# EAGLE design USB - UART link (EAGLE 8.0.1)
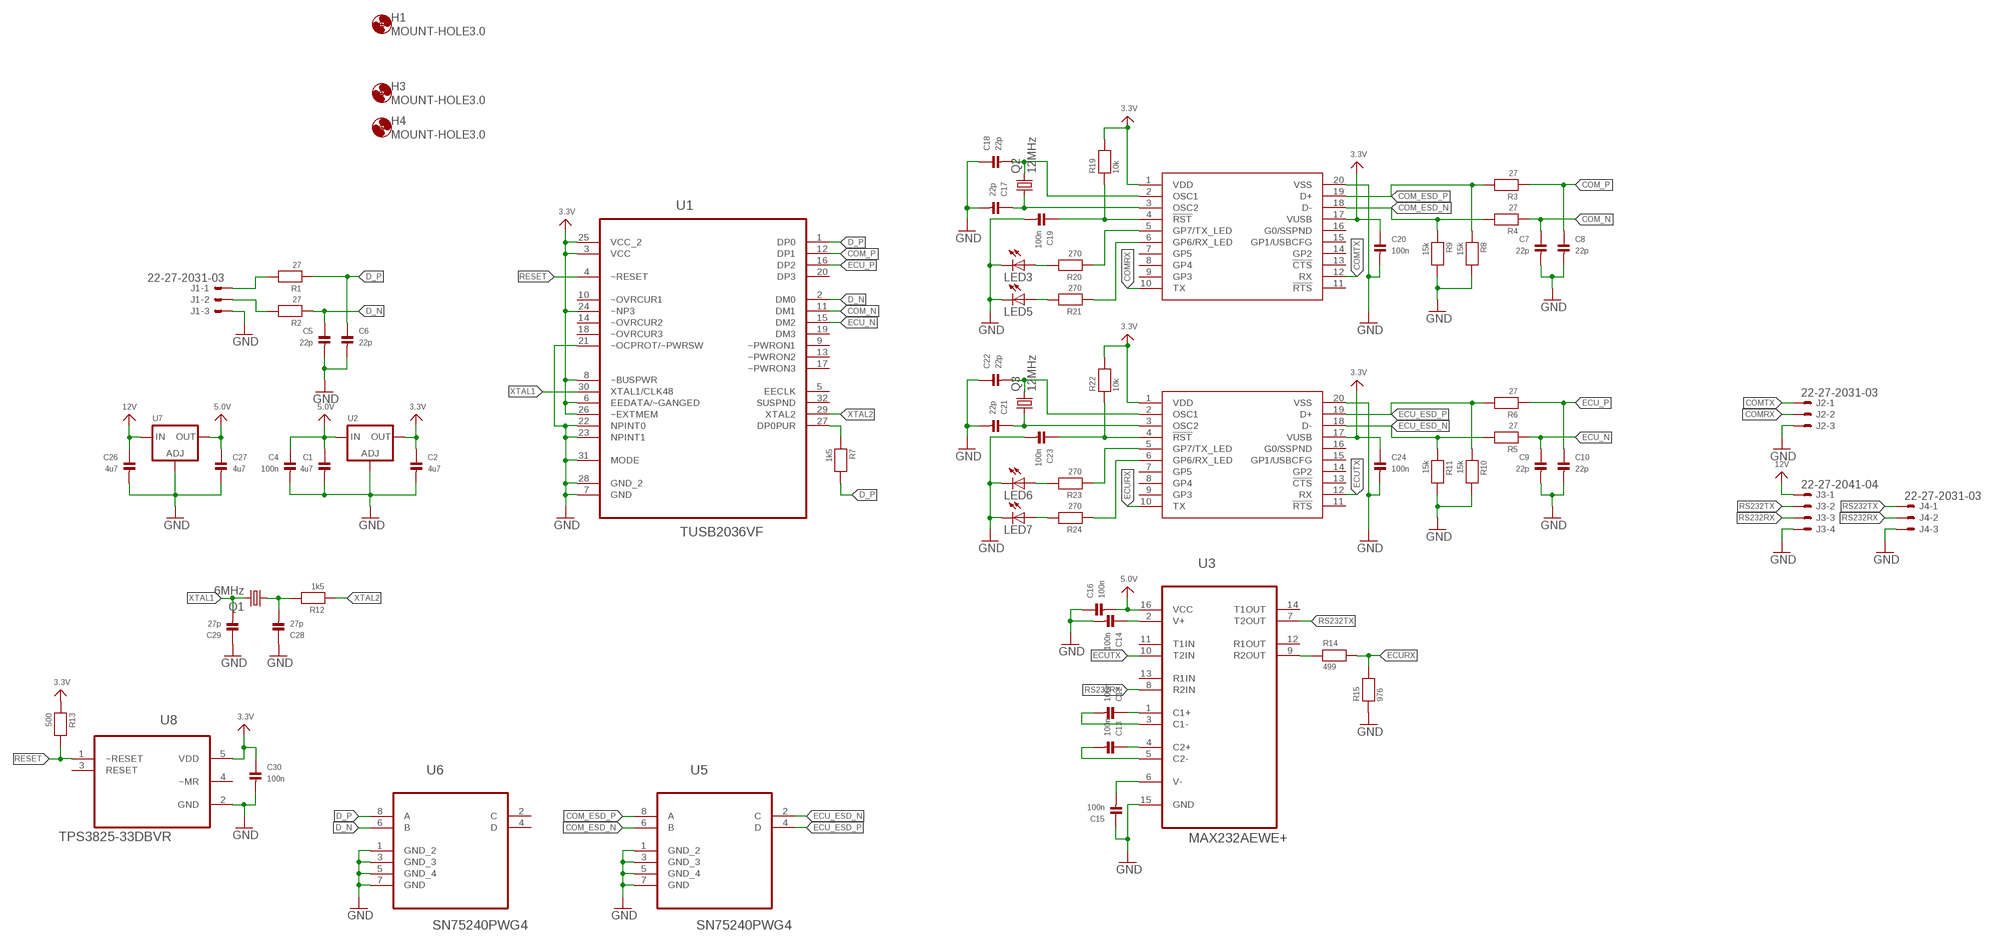
[diagram p0: schematic, sheet 1]

## Parts
C1  4u7  CAP_CERAMIC_0805  [_0805]
C2  4u7  CAP_CERAMIC_0805  [_0805]
C4  100n  CAP_CERAMIC_0603  [_0603]
C5  22p  CAP_CERAMIC_0603  [_0603]
C6  22p  CAP_CERAMIC_0603  [_0603]
C7  22p  CAP_CERAMIC_0603  [_0603]
C8  22p  CAP_CERAMIC_0603  [_0603]
C9  22p  CAP_CERAMIC_0603  [_0603]
C10  22p  CAP_CERAMIC_0603  [_0603]
C12  100n  CAP_CERAMIC_0603  [_0603]
C13  100n  CAP_CERAMIC_0603  [_0603]
C14  100n  CAP_CERAMIC_0603  [_0603]
C15  100n  CAP_CERAMIC_0603  [_0603]
C16  100n  CAP_CERAMIC_0603  [_0603]
C17  22p  CAP_CERAMIC_0603  [_0603]
C18  22p  CAP_CERAMIC_0603  [_0603]
C19  100n  CAP_CERAMIC_0603  [_0603]
C20  100n  CAP_CERAMIC_0603  [_0603]
C21  22p  CAP_CERAMIC_0603  [_0603]
C22  22p  CAP_CERAMIC_0603  [_0603]
C23  100n  CAP_CERAMIC_0603  [_0603]
C24  100n  CAP_CERAMIC_0603  [_0603]
C26  4u7  CAP_CERAMIC_0805  [_0805]
C27  4u7  CAP_CERAMIC_0805  [_0805]
C28  27p  CAP_CERAMIC_0603  [_0603]
C29  27p  CAP_CERAMIC_0603  [_0603]
C30  100n  CAP_CERAMIC_0603  [_0603]
H1  MOUNT-HOLE3.0  [3,0]
H3  MOUNT-HOLE3.0  [3,0]
H4  MOUNT-HOLE3.0  [3,0]
J1  22-27-2031-03  [6410-03]
J2  22-27-2031-03  [6410-03]
J3  22-27-2041-04  [6410-04]
J4  22-27-2031-03  [6410-03]
LED3  LEDCHIPLED_0805  [CHIPLED_0805]
LED5  LEDCHIPLED_0805  [CHIPLED_0805]
LED6  LEDCHIPLED_0805  [CHIPLED_0805]
LED7  LEDCHIPLED_0805  [CHIPLED_0805]
Q1  6MHz  CRYSTALHC49S  [HC49/S]
Q2  12MHz  CRYSTALHC49S  [HC49/S]
Q3  12MHz  CRYSTALHC49S  [HC49/S]
R1  27  RESISTOR_0603  [_0603]
R2  27  RESISTOR_0603  [_0603]
R3  27  RESISTOR_0603  [_0603]
R4  27  RESISTOR_0603  [_0603]
R5  27  RESISTOR_0603  [_0603]
R6  27  RESISTOR_0603  [_0603]
R7  1k5  RESISTOR_0603  [_0603]
R8  15k  RESISTOR_0603  [_0603]
R9  15k  RESISTOR_0603  [_0603]
R10  15k  RESISTOR_0603  [_0603]
R11  15k  RESISTOR_0603  [_0603]
R12  1k5  RESISTOR_0603  [_0603]
R13  500  RESISTOR_0603  [_0603]
R14  499  RESISTOR_0603  [_0603]
R15  976  RESISTOR_0603  [_0603]
R19  10k  RESISTOR_0603  [_0603]
R20  270  RESISTOR_0603  [_0603]
R21  270  RESISTOR_0603  [_0603]
R22  10k  RESISTOR_0603  [_0603]
R23  270  RESISTOR_0603  [_0603]
R24  270  RESISTOR_0603  [_0603]
U1  TUSB2036VF  [QFP80P900X900X145-32N]
U2  LM1117SOT223-REFLOW  [SOT223-R]
U3  MAX232AEWE+  [SOIC127P1032X265-16N]
U5  SN75240PWG4  [SOP65P640X120-8N]
U6  SN75240PWG4  [SOP65P640X120-8N]
U7  LM1117SOT223-REFLOW  [SOT223-R]
U8  TPS3825-33DBVR  [SOT95P280X145-5N]
U$24  MCP2200  [SO20L]
U$29  MCP2200  [SO20L]

## Nets
3.3V: C2.1 C20.1 C24.1 C30.1 R13.1 R19.2 R22.2 U1.3(VCC) U1.6(EEDATA/~GANGED) U1.8(~BUSPWR) U1.24(~NP3) U1.25(VCC_2) U1.26(~EXTMEM) U2.2(OUT) U8.5(VDD) U$24.1(VDD) U$24.17(VUSB) U$29.1(VDD) U$29.17(VUSB)
5.0V: C1.1 C4.1 C16.2 C27.1 U2.3(IN) U3.16(VCC) U7.2(OUT)
12V: C26.1 J3.1 U7.3(IN)
COM_ESD_N: R4.2 R9.1 U5.6(B) U$24.18(D-)
COM_ESD_P: R3.2 R8.1 U5.8(A) U$24.19(D+)
COM_N: C7.1 R4.1 U1.11(DM1)
COM_P: C8.1 R3.1 U1.12(DP1)
COMRX: J2.2 U$24.10(TX)
COMTX: J2.1 U$24.12(RX)
D_N: C5.1 R2.1 U1.2(DM0) U6.6(B)
D_P: C6.1 R1.1 R7.2 U1.1(DP0) U6.8(A)
DO_N: J1.2 R2.2
DO_P: J1.1 R1.2
ECU_ESD_N: R5.2 R11.1 U5.2(C) U$29.18(D-)
ECU_ESD_P: R6.2 R10.1 U5.4(D) U$29.19(D+)
ECU_N: C9.1 R5.1 U1.15(DM2)
ECU_P: C10.1 R6.1 U1.16(DP2)
ECURX: R14.2 R15.2 U$29.10(TX)
ECUTX: U3.10(T2IN) U$29.12(RX)
GND: C1.2 C2.2 C4.2 C5.2 C6.2 C7.2 C8.2 C9.2 C10.2 C14.2 C15.1 C16.1 C17.2 C18.1 C19.2 C20.2 C21.2 C22.1 C23.2 C24.2 C26.2 C27.2 C28.1 C29.1 C30.2 J1.3 J2.3 J3.4 J4.3 LED3.C LED5.C LED6.C LED7.C R8.2 R9.2 R10.2 R11.2 R15.1 U1.7(GND) U1.21(~OCPROT/~PWRSW) U1.22(NPINT0) U1.23(NPINT1) U1.28(GND_2) U1.31(MODE) U2.1(ADJ) U3.15(GND) U5.1(GND_2) U5.3(GND_3) U5.5(GND_4) U5.7(GND) U6.1(GND_2) U6.3(GND_3) U6.5(GND_4) U6.7(GND) U7.1(ADJ) U8.2(GND) U$24.20(VSS) U$29.20(VSS)
N$1: R14.1 U3.9(R2OUT)
N$5: R7.1 U1.27(DP0PUR)
N$8: C13.1 U3.4(C2+)
N$9: C12.2 U3.3(C1-)
N$10: C12.1 U3.1(C1+)
N$12: C28.2 Q1.1 R12.2
N$13: C15.2 U3.6(V-)
N$15: C14.1 U3.2(V+)
N$20: C13.2 U3.5(C2-)
N$25: C22.2 Q3.2 U$29.2(OSC1)
N$26: C18.2 Q2.2 U$24.2(OSC1)
N$27: C17.1 Q2.1 U$24.3(OSC2)
N$28: C21.1 Q3.1 U$29.3(OSC2)
N$29: R21.1 U$24.6(GP6/RX_LED)
N$36: R20.1 U$24.5(GP7/TX_LED)
N$43: C19.1 R19.1 U$24.4(!RST)
N$44: R24.1 U$29.6(GP6/RX_LED)
N$45: R23.1 U$29.5(GP7/TX_LED)
N$46: LED3.A R20.2
N$47: LED5.A R21.2
N$48: C23.1 R22.1 U$29.4(!RST)
N$55: LED6.A R23.2
N$56: LED7.A R24.2
RESET: R13.2 U1.4(~RESET) U8.1(~RESET)
RS232RX: J3.3 J4.2 U3.8(R2IN)
RS232TX: J3.2 J4.1 U3.7(T2OUT)
XTAL1: C29.2 Q1.2 U1.30(XTAL1/CLK48)
XTAL2: R12.1 U1.29(XTAL2)
Unconnected: U1.5(EECLK) U1.9(~PWRON1) U1.10(~OVRCUR1) U1.13(~PWRON2) U1.14(~OVRCUR2) U1.17(~PWRON3) U1.18(~OVRCUR3) U1.19(DM3) U1.20(DP3) U1.32(SUSPND) U3.11(T1IN) U3.12(R1OUT) U3.13(R1IN) U3.14(T1OUT) U6.2(C) U6.4(D) U8.3(RESET) U8.4(~MR) U$24.7(GP5) U$24.8(GP4) U$24.9(GP3) U$24.11(!RTS) U$24.13(!CTS) U$24.14(GP2) U$24.15(GP1/USBCFG) U$24.16(G0/SSPND) U$29.7(GP5) U$29.8(GP4) U$29.9(GP3) U$29.11(!RTS) U$29.13(!CTS) U$29.14(GP2) U$29.15(GP1/USBCFG) U$29.16(G0/SSPND)

## Library data of the parts
C1 C2 C4-C10 C12-C24 C26-C30 = microbuilder:CAP_CERAMIC: Ceramic Capacitors 0402 - 0402 Surface Mount Capacitors 16pF 50V 5% [Digikey: 445-4899-2-ND] 18pF 50V 5% [Digikey: 490-1281-2-ND] 22pF 50V 5% [Digikey: 490-1283-2-ND] 68pF 50V 5% [Digikey: 490-1289-2-ND] 0.1uF 10V 10% [Digikey: 490-1318-2-ND] 1.0uF 6.3V 10% [Digikey: 490-1320-2-ND] 0603 - 0603 Surface Mount Capacitors 16 pF 50V 5% [Digikey: 445-5051-2-ND] 22 pF 50V [Digikey: PCC220ACVTR-ND] 33 pF 50V 5% [Digikey: 490-1415-1-ND] 56pF 50V 5% [Digikey: 490-1421-1-ND] 220pF 50V 5% [Digikey: 445-1285-1-ND] 680 pF 50V 2200 pF 50V 5% C0G [Digikey: 445-1297-1-ND] 5600 pF 100V 5% X7R [Digikey: 478-3711-1-ND] 0.1 µF 25V 10% [Digikey: PCC2277TR-ND] 0.22 µF 16V 10% X7R [Digikey: 445-1318-1-ND] 1.0 µF 25V 10% [Digikey: 445-5146-2-ND] 0603 - RF Specific 3pF 250V +/-0.1pF RF [Digikey: 712-1347-1-ND] 18 pF 250V 5% [Digikey: 478-3505-1-ND or 712-1322-1-ND] 56 pF 250V 5% C0G RF [Digikey: 490-4867-1-ND] 68 pF 250V RF [Digikey: 490-4868-1-ND] 0805 - 0805 Surface Mount Capacitors 220 pF 250V 2% RF Ceramic Capacitor [Digikey: 712-1398-1-ND] 1000 pF 50V 2% NP0 Ceramic Capacitor [Digikey: 478-3760-1-ND] 0.1 µF 25V 10% Ceramic Capacitor [Digikey: PCC1828TR-ND] 1.0 µF 16V 10% Ceramic Capacitor[Digikey: 490-1691-2-ND] 10.0 µF 10V 10% Ceramic Capacitor[Digikey: 709-1228-1-ND] 10.0 uF 16V 10% Ceramic Capacitor [Digikey: 478-5165-2-ND] 47 uF 6.3V 20% Ceramic Capacitor [Digikey: 587-1779-1-ND or 399-5506-1-ND] 1206 - 1206 Surface Mount Capacitors 47uF 10V 20% Ceramic Capacitor [Digikey: 490-5528-1-ND or 399-5508-1-ND or 445-6010-1-ND] 100uF 6.3V -20%, +80% Y5V Ceramic Capacitor (Digikey: 490-4512-1-ND, Mouser: 81-GRM31CF50J107ZE1L)
H1 H3 H4 = holes:MOUNT-HOLE: MOUNTING HOLE with drill center marker
J1 J2 J4 = con-molex:22-?-03: CONNECTOR wire to board 2.54 mm (.1 inch) pitch header; OC_FARNELL: unknown; OC_NEWARK: unknown
J3 = con-molex:22-?-04: CONNECTOR wire to board 2.54 mm (.1 inch) pitch header; OC_FARNELL: unknown; OC_NEWARK: unknown
LED3 LED5-LED7 = adafruit:LED: LED OSRAM: - CHIPLED LG R971, LG N971, LY N971, LG Q971, LY Q971, LO R971, LY R971 LH N974, LH R974 LS Q976, LO Q976, LY Q976 LO Q996 - Hyper CHIPLED LW Q18S LB Q993, LB Q99A, LB R99A - SideLED LS A670, LO A670, LY A670, LG A670, LP A670 LB A673, LV A673, LT A673, LW A673 LH A674 LY A675 LS A676, LA A676, LO A676, LY A676, LW A676 LS A679, LY A679, LG A679 - Hyper Micro SIDELED® LS Y876, LA Y876, LO Y876, LY Y876 LT Y87S - SmartLED LW L88C, LW L88S LB L89C, LB L89S, LG L890 LS L89K, LO L89K, LY L89K LS L896, LA L896, LO L896, LY L896 - TOPLED LS T670, LO T670, LY T670, LG T670, LP T670 LSG T670, LSP T670, LSY T670, LOP T670, LYG T670 LG T671, LOG T671, LSG T671 LB T673, LV T673, LT T673, LW T673 LH T674 LS T676, LA T676, LO T676, LY T676, LB T676, LH T676, LSB T676, LW T676 LB T67C, LV T67C, LT T67C, LS T67K, LO T67K, LY T67K, LW E67C LS E67B, LA E67B, LO E67B, LY E67B, LB E67C, LV E67C, LT E67C LW T67C LS T679, LY T679, LG T679 LS T770, LO T770, LY T770, LG T770, LP T770 LB T773, LV T773, LT T773, LW T773 LH T774 LS E675, LA E675, LY E675, LS T675 LS T776, LA T776, LO T776, LY T776, LB T776 LHGB T686 LT T68C, LB T68C - Hyper Mini TOPLED® LB M676 - Mini TOPLED Santana® LG M470 LS M47K, LO M47K, LY M47K Source: http://www.osram.convergy.de/
Q1-Q3 = adafruit:CRYSTAL: CRYSTAL; OC_FARNELL: 1667008; OC_NEWARK: unknown
R1-R15 R19-R24 = microbuilder:RESISTOR: Resistors 0402 - 0402 Surface Mount Package 22 Ohm 1% 1/16W [Digikey: 311-22.0LRTR-ND] 33 Ohm 5% 1/16W 1.0K 5% 1/16W 1.5K 5% 1/16W 2.0K 1% 1/16W 10.0K 1% 1/16W [Digikey: 311-10.0KLRTR-ND] 10.0K 5% 1/16W [Digikey: RMCF0402JT10K0TR-ND] 12.1K 1% 1/16W [Digikey: 311-22.0LRTR-ND] 100.0K 5% 1/16W 0603 - 0603 Surface Mount Package 0 Ohm 1/10 Watt 1% Resistor 15 Ohm 1/10 Watt 1% Resistor 33 Ohm 1/10 Watt 1% Resistor 49.9 Ohm 1/10 Watt 1% Resistor 100 Ohm 1/10 Watt 1% Resistor 150 Ohm 1/10 Watt 1% Resistor 240 Ohm 1/10 Watt 1% Resistor 390 Ohm 1/10 Watt 1% Resistor 560 Ohm 1/10 Watt 1% Resistor 680 Ohm 1/10 Watt 1% Resistor 750 Ohm 1/10 Watt 1% Resistor 1.0K Ohm 1/10 Watt 1% Resistor 1.5K Ohm 1/10 Watt 1% Resistor 2.0K Ohm 1/10 Watt 1% Resistor 2.2K Ohm 1/10 Watt 1% Resistor 3.3K Ohm 1/10 Watt 1% Resistor 4.7K Ohm 1/10 Watt 1% Resistor 10.0K Ohm 1/10 Watt 1% Resistor 12.0K Ohm 1/10 Watt 1% Resistor 12.1K Ohm 1/10 Watt 1% Resistor 20.0K Ohm 1/10 Watt 1% Resistor 33.0K Ohm 1/10 Watt 1% Resistor 100.0K Ohm 1/10 Watt 1% Resistor 0805 - 0805 Surface Mount Package 0 Ohm 1/8 Watt 1% Resistor 33 Ohm 1/8 Watt 1% Resistor 100 Ohm 1/8 Watt 1% Resistor 150 Ohm 1/8 Watt 1% Resistor 200 Ohm 1/8 Watt 1% Resistor 240 Ohm 1/8 Watt 1% Resistor 330 Ohm 1/8 Watt 1% Resistor 390 Ohm 1/8 Watt 1% Resistor 470 Ohm 1/8 Watt 1% Resistor 1.0K Ohm 1/8 Watt 1% Resistor 1.5K Ohm 1/8 Watt 1% Resistor 2.0K Ohm 1/8 Watt 1% Resistor 4.7K Ohm 1/8 Watt 1% Resistor 5.1K Ohm 1/8 Watt 1% Resistor 5.6K Ohm 1/8 Watt 1% Resistor 10.0K Ohm 1/8 Watt 1% Resistor 22.0K Ohm 1/8 Watt 1% Resistor 33.0K Ohm 1/8 Watt 1% Resistor 100K Ohm 1/8 Watt 1% Resistor 1206 - 1206 Surface Mount Package 2012 - 2010 Surface Mount Package 0.11 Ohm 1/2 Watt 1% Resistor - Digikey: RHM.11UCT-ND
U1 = Texas Instruments_By_element14_Batch_1:TUSB2036VF: 2/3 port Hub for the Universal serial bus with optional serial EEPROM Interface; MPN: TUSB2036VF; OC_FARNELL: 1610199; OC_NEWARK: 77C1802; PACKAGE: LQFP-32; SUPPLIER: Texas Instruments
U2 U7 = microbuilder:LM1117: LM1117 Voltage Regulator LM1117 Adjustable Voltage regulator [Digikey: LM1117IMP-ADJDKR-ND] LM1117 3.3V Voltage regulator [AP1117E33GDIDKR-ND] LM1117 5.0V Voltage regulator [AP1117E50GDIDKR-ND] SOT223-REFLOW - SOT223 package for solder paste/reflow ovens SOT223-WAVE - SOT223 package for hand-soldering (larger pads) Note: For the fixed-voltage regulators, simply set the ADJ pin to GND.
U3 = Maxim_By_element14_Batch_1:MAX232AEWE+: +5V-Powered, Multichannel RS-232 Drivers/Receivers; MPN: MAX232AEWE+; OC_FARNELL: 9724400; OC_NEWARK: 67K4435; PACKAGE: SOIC-16; SUPPLIER: Maxim
U5 U6 = Texas Instruments_By_element14_Batch_1:SN75240PWG4: USB Port Transient Suppressors; MPN: SN75240PWG4; OC_FARNELL: 1207275; OC_NEWARK: 24M7629; PACKAGE: TSSOP-8; SUPPLIER: Texas Instruments
U8 = Texas Instruments_By_element14_Batch_1:TPS3825-33DBVR: PROCESSOR SUPERVISORY CIRCUITS; MPN: TPS3825-33DBVR; OC_FARNELL: 1535758; OC_NEWARK: 77C0425; PACKAGE: SOT-23-5; SUPPLIER: Texas Instruments
U$24 U$29 = mcp2200:MCP2200: USB to serial converter by micreochip

## Board
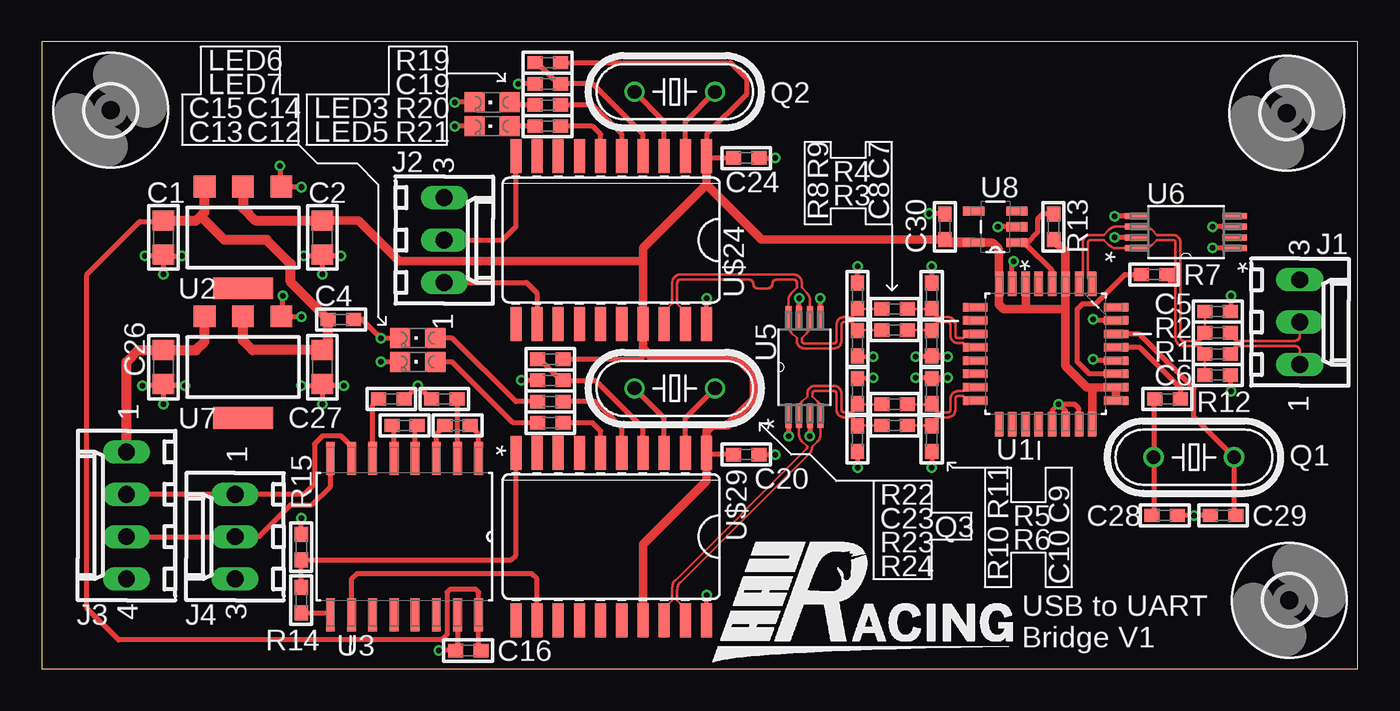
[diagram p1: board, top side]
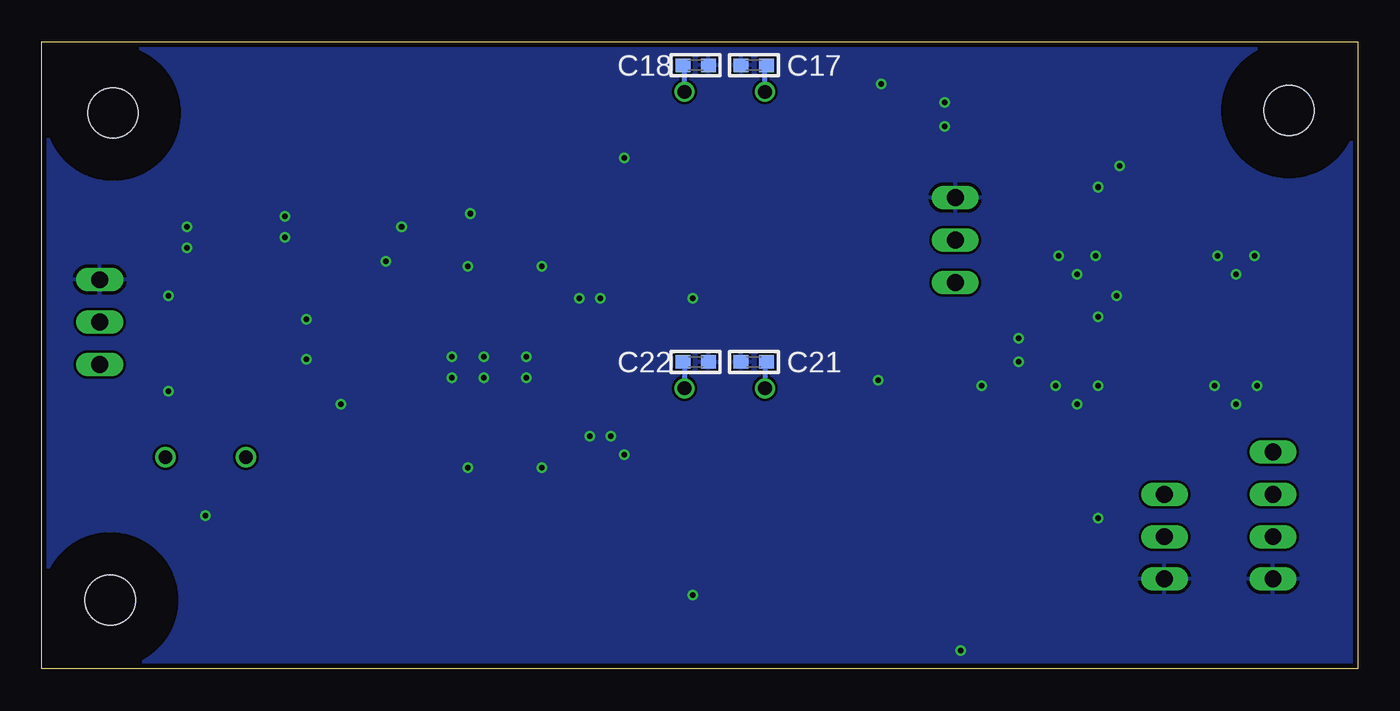
[diagram p2: board, bottom side, seen from below]

Size 78.88 x 37.61 mm. Coordinates in mm from the lower left corner, seen from the top.
Outline: 0,0 78.88,0 78.88,37.61 0,37.61 0,0
Copper layers (1*16): Top 0.035mm / dielectric 1.5mm / Bottom 0.035mm
Design rules "PCB-POOL Standard": minimum track width 0.15mm, minimum drill 0.3mm, track to track 0.15mm, track to pad 0.15mm, pad to pad 0.15mm, via to via 0.15mm, smd to smd 0.15mm, copper to edge 0.3mm, drill to drill 0.2mm, minimum pad ring 0.2mm, minimum via ring 0.15mm, stop-mask expansion 0.075mm, vias tented up to drill 0mil, thermal gap 0.2mm

### Footprints (pad centres in the part's own frame; a part is rotated, then mirrored left to right if it is on the bottom)
_0805 = smd 1.2 x 1.3: 1 -1.016,0; 2 1.016,0
_0603 = smd 0.9 x 0.8: 1 -0.762,0; 2 0.762,0
3,0 = hole 3: 0,0
6410-03 = drill 1.016 long: 1 2.54,0; 2 0,0; 3 -2.54,0
6410-04 = drill 1.016 long: 1 3.81,0; 2 1.27,0; 3 -1.27,0; 4 -3.81,0
CHIPLED_0805 = smd 1.2 x 1.2: A 0,-1.05; C 0,1.05
HC49/S = drill 0.813: 1 -2.413,0; 2 2.413,0
QFP80P900X900X145-32N = smd 1.473 x 0.508: 1 -4.216,2.794; 2 -4.216,2.007; 3 -4.216,1.194; 4 -4.216,0.406; 5 -4.216,-0.406; 6 -4.216,-1.194; 7 -4.216,-2.007; 8 -4.216,-2.794; 17 4.216,-2.794; 18 4.216,-2.007; 19 4.216,-1.194; 20 4.216,-0.406; 21 4.216,0.406; 22 4.216,1.194; 23 4.216,2.007; 24 4.216,2.794 | smd 0.508 x 1.473: 9 -2.794,-4.216; 10 -2.007,-4.216; 11 -1.194,-4.216; 12 -0.406,-4.216; 13 0.406,-4.216; 14 1.194,-4.216; 15 2.007,-4.216; 16 2.794,-4.216; 25 2.794,4.216; 26 2.007,4.216; 27 1.194,4.216; 28 0.406,4.216; 29 -0.406,4.216; 30 -1.194,4.216; 31 -2.007,4.216; 32 -2.794,4.216
SOT223-R = smd 1.3 x 1.3: 1 -2.3,-3.05; 2 0,-3.05; 3 2.3,-3.05 | smd 3.6 x 1.3: 4 0,3.05
SOIC127P1032X265-16N = smd 1.981 x 0.533: 1 -4.699,4.445; 2 -4.699,3.175; 3 -4.699,1.905; 4 -4.699,0.635; 5 -4.699,-0.635; 6 -4.699,-1.905; 7 -4.699,-3.175; 8 -4.699,-4.445; 9 4.699,-4.445; 10 4.699,-3.175; 11 4.699,-1.905; 12 4.699,-0.635; 13 4.699,0.635; 14 4.699,1.905; 15 4.699,3.175; 16 4.699,4.445
SOP65P640X120-8N = smd 1.473 x 0.356: 1 -2.921,0.965; 2 -2.921,0.33; 3 -2.921,-0.33; 4 -2.921,-0.965; 5 2.921,-0.965; 6 2.921,-0.33; 7 2.921,0.33; 8 2.921,0.965
SOT95P280X145-5N = smd 1.27 x 0.559: 1 -1.295,0.94; 2 -1.295,0; 3 -1.295,-0.94; 4 1.295,-0.94; 5 1.295,0.94
SO20L = smd 0.66 x 2.032: 1 -5.715,-5.029; 2 -4.445,-5.029; 3 -3.175,-5.029; 4 -1.905,-5.029; 5 -0.635,-5.029; 6 0.635,-5.029; 7 1.905,-5.029; 8 3.175,-5.029; 9 4.445,-5.029; 10 5.715,-5.029; 11 5.715,5.029; 12 4.445,5.029; 13 3.175,5.029; 14 1.905,5.029; 15 0.635,5.029; 16 -0.635,5.029; 17 -1.905,5.029; 18 -3.175,5.029; 19 -4.445,5.029; 20 -5.715,5.029

### Placement (x,y rotation side)
C1  7.3,25.88 270 top
C2  16.83,25.88 270 top
C4  17.94,20.95 0 top
C5  70.48,21.43 0 top
C6  70.48,17.62 0 top
C7  53.34,22.38 90 top
C8  53.34,19.53 270 top
C9  53.34,16.67 90 top
C10  53.34,13.81 270 top
C12  24.92,14.61 180 top
C13  21.75,14.61 180 top
C14  24.13,16.19 180 top
C15  20.95,16.19 180 top
C16  25.56,1.11 0 top
C17  36.2,36.2 180 bottom
C18  39.69,36.2 180 bottom
C19  30.32,35.08 180 top
C20  42.23,12.86 0 top
C21  36.2,18.41 180 bottom
C22  39.69,18.41 180 bottom
C23  30.48,17.3 180 top
C24  42.23,30.64 0 top
C26  7.3,18.1 270 top
C27  16.83,18.1 270 top
C28  67.31,9.21 180 top
C29  70.8,9.21 0 top
C30  54.13,26.51 90 top
H1  4.13,33.5 0 top
H3  74.61,33.34 0 top
H4  74.77,4.13 0 top
J1  75.41,20.8 270 top
J2  24.13,25.72 270 top
J3  5.08,9.21 90 top
J4  11.59,7.94 90 top
LED3  26.99,33.97 90 top
LED5  26.99,32.54 90 top
LED6  22.54,19.84 90 top
LED7  22.54,18.41 90 top
Q1  69.06,12.7 0 top
Q2  37.94,34.61 0 top
Q3  37.94,16.83 0 top
R1  70.48,18.89 0 top
R2  70.48,20.16 0 top
R3  51.12,20.32 180 top
R4  51.12,21.59 180 top
R5  51.12,15.88 180 top
R6  51.12,14.61 180 top
R7  66.67,23.65 0 top
R8  48.9,19.53 270 top
R9  48.9,22.38 90 top
R10  48.9,13.81 270 top
R11  48.9,16.67 90 top
R12  67.47,16.19 180 top
R13  60.64,26.51 90 top
R14  15.56,4.13 90 top
R15  15.56,7.3 270 top
R19  30.32,36.35 0 top
R20  30.32,33.81 180 top
R21  30.32,32.54 180 top
R22  30.48,18.57 0 top
R23  30.48,16.03 180 top
R24  30.48,14.76 180 top
U1  60.17,18.89 270 top
U2  12.06,25.88 180 top
U3  21.75,7.94 270 top
U5  45.72,18.1 90 top
U6  68.58,26.19 180 top
U7  12.06,18.1 180 top
U8  57.15,26.51 180 top
U$24  34.13,25.72 180 top
U$29  34.13,7.94 180 top

### Tracks (layer width: path | path; a pad name or v marks a point on that pad's centre or on a via)
3.3V
  Top 0.305: 55.87,25.56 U8.5 | R22.2 35.88,18.57 36.27,18.97 | R19.2 41.27,36.35 42.23,35.4 42.23,34.45 39.85,32.07 U$24.1 39.95,30.64 C24.1 | C20.1 39.95,12.86 U$29.1
  Top 0.508: U1.25 U1.26 63.02,16.89 | 61.36,21.59 U1.3 61.36,25.03 R13.1 | 61.36,21.59 61.36,18.17 62.65,16.89 63.02,16.89 | 58.97,21.59 U1.6 | 58.97,21.59 61.36,21.59 | 58.97,21.59 57.63,21.59 57.37,21.84 U1.8 57.37,25.18 56.99,25.56 55.87,25.56 | 54.31,25.57 C30.1 43.15,25.75 39.85,29.05 | U$29.17 36.04,7.46 39.85,11.27 U$29.1 39.85,14.29 40.16,14.61 41.12,14.61 42.7,16.19 42.7,17.62 41.59,18.73 36.51,18.73 36.27,18.97 36.04,19.21 U$24.17 36.04,24.45 | 36.04,24.45 36.04,25.24 39.85,29.05 | U$24.1 39.85,29.05 | C2.1 18.99,26.89 21.43,24.45 36.04,24.45 | U1.24 62.96,16.82 63.02,16.89
  Top 0.61: U8.5 54.31,25.57 | U2.2 12.06,27.62 12.79,26.89 C2.1
5.0V
  Top 0.305: C16.2 26.19,1.24 U3.16 26.19,4.6 26.04,4.76 24.45,4.76 24.29,4.6 24.29,2.06 23.97,1.75 4.6,1.75 2.7,3.65 2.7,23.65 5.87,26.83 7.24,26.83 C1.1
  Top 0.61: U7.2 12.06,19.68 12.64,19.11 C27.1 17.18,19.46 C4.1 14.92,23.21 14.92,24.29 13.49,25.72 10.95,25.72 9.53,27.15 | C1.1 9.27,26.89 9.53,27.15 | U2.3 9.77,27.39 9.53,27.15
12V
  Top 0.61: U7.3 9.77,19.61 9.27,19.11 C26.1 5.78,19.11 5.08,18.41 J3.1
COM_ESD_N
  Top 0.15: R4.2 48.93,21.59 R9.1 arc-90 48.38,21.11 48.1,21.11 arc90 47.63,20.64 47.63,19.68 arc-90 47.47,19.52 45.72,19.52 arc-90 45.55,19.68 45.55,19.84 45.86,20.16 arc45 46.05,20.76 U5.6 46.05,22.1 arc45 45.86,22.55 45.55,22.86 45.55,23.18 arc90 45.09,23.64 38.26,23.64 arc90 37.79,23.18 37.79,21.91 37.49,21.61 arc45 37.31,21.16 U$24.18
COM_ESD_P
  Top 0.15: R3.2 48.93,20.32 R8.1 arc90 48.38,20.8 48.1,20.8 arc90 47.93,20.64 47.93,19.68 arc-90 47.47,19.22 45.72,19.22 arc-90 45.25,19.68 45.25,19.84 44.94,20.16 arc-45 44.76,20.76 U5.8 44.76,22.1 arc-45 44.94,22.55 45.25,22.86 45.25,23.18 arc90 45.09,23.34 44.05,23.34 arc90 43.79,23.08 arc-90 43.52,22.82 42.91,22.82 arc-90 42.65,23.08 arc90 42.39,23.34 38.26,23.34 arc90 38.09,23.18 38.09,21.91 38.39,21.61 arc-45 38.58,21.16 U$24.19
COM_N
  Top 0.15: R4.1 53.31,21.59 C7.1 arc45 53.37,21.55 arc90 53.82,21.11 54.29,21.11 arc-90 54.76,20.64 54.76,20 arc90 54.93,19.84 55.24,19.84 55.31,19.9 arc-45 55.76,20.09 U1.11
COM_P
  Top 0.15: R3.1 53.31,20.32 C8.1 | C8.1 arc-45 53.37,20.36 | U1.12 55.74,19.3 arc-45 55.3,19.48 55.24,19.54 54.93,19.54 arc-90 54.46,20 54.46,20.64 arc90 54.29,20.8 53.86,20.8 arc90 C8.1
COMRX
  Top 0.305: J2.2 27.62,25.72 28.42,26.51 U$24.10
COMTX
  Top 0.305: J2.1 29.05,23.18 29.69,22.54 U$24.12
D_N
  Top 0.15: C5.1 R2.1 arc-90 69.24,19.68 68.42,19.68 arc-90 68.25,19.84 68.25,25.56 arc90 67.79,26.03 66.83,26.03 66.52,26.34 arc45 66.07,26.52 U6.6 64.42,26.52 arc45 63.97,26.34 63.66,26.03 62.87,26.03 arc90 62.4,25.56 62.4,23.59 arc-45 62.21,23.15 U1.2
D_P
  Top 0.15: C6.1 R1.1 arc90 69.24,19.38 68.42,19.38 arc-90 67.95,19.84 67.95,23.34 | U1.1 62.88,23.18 arc-45 62.7,23.63 62.7,25.56 arc-90 62.87,25.73 63.66,25.73 63.97,25.41 arc45 64.42,25.23 U6.8 66.07,25.23 arc45 66.52,25.41 66.83,25.73 67.79,25.73 arc-90 67.95,25.56 67.95,23.34 | R7.2 67.57,23.18 arc45 67.95,23.34
DO_N
  Top 0.15: R2.2 arc90 71.73,19.68 75.09,19.68 arc90 75.41,19.99 J1.2
DO_P
  Top 0.15: R1.2 arc-90 71.73,19.38 75.09,19.38 arc-90 75.41,19.06 J1.1
ECU_ESD_N
  Top 0.15: R5.2 48.93,15.88 R11.1 48.9,15.87 arc-90 48.42,15.39 48.1,15.39 arc-90 47.93,15.56 47.93,16.51 arc90 47.47,16.98 46.35,16.98 arc90 45.89,16.51 45.89,16.35 45.58,16.04 arc45 45.39,15.59 U5.2 45.39,14.1 arc45 45.58,13.65 45.89,13.34 arc-45 45.82,13.17 37.98,5.33 arc45 37.79,4.88 37.79,4.13 37.49,3.83 arc45 37.31,3.38 U$29.18
ECU_ESD_P
  Top 0.15: R6.2 48.93,14.61 R10.1 48.9,14.61 arc90 48.42,15.09 48.1,15.09 arc-90 47.63,15.56 47.63,16.51 arc90 47.47,16.68 46.35,16.68 arc90 46.19,16.51 46.19,16.35 46.5,16.04 arc-45 46.69,15.59 U5.4 46.69,14.1 arc-45 46.5,13.65 46.19,13.34 arc-45 46.03,12.96 38.28,5.2 arc45 38.09,4.75 38.09,4.13 38.39,3.83 arc-45 38.58,3.38 U$29.19
ECU_N
  Top 0.15: R5.1 53.31,15.88 C9.1 arc90 53.86,15.39 54.29,15.39 arc90 54.46,15.56 54.46,16.19 arc-90 54.93,16.66 55.24,16.66 55.28,16.7 arc-45 55.73,16.89 U1.15
ECU_P
  Top 0.15: R6.1 53.31,14.61 C10.1 arc-90 53.86,15.09 54.29,15.09 arc90 54.76,15.56 54.76,16.19 arc-90 54.93,16.36 55.24,16.36 55.32,16.28 arc45 55.77,16.1 U1.16
ECURX
  Top 0.305: R14.2 R15.2 28.13,6.54 28.42,6.83 U$29.10
ECUTX
  Top 0.305: U3.10 18.57,5.4 18.89,5.71 29.37,5.71 29.69,5.4 U$29.12
GND  (via drill 0.33)
  Top 0.305: R8.2 arc90 48.93,18.73 v49.85,18.73 | R11.2 arc-90 48.93,17.46 v49.85,17.46 | C9.2 arc90 53.31,17.46 v52.39,17.46 | C8.2 arc-90 53.31,18.73 v52.39,18.73 | U1.21 60.57,15.49 v60.96,15.88 | U1.22 61.36,15.47 v60.96,15.88 | U1.28 63.11,18.48 v63.02,18.57 | U1.31 63.08,20.9 v63.02,20.95 | U1.7 58.16,24.35 v58.26,24.45 | U6.7 64.31,25.86 v64.29,25.88 | U6.5 64.31,27.16 v64.29,27.15 | U6.1 70.18,25.23 v70.17,25.24 | U6.3 70.18,26.52 v70.17,26.51 | v71.28,16.67 71.28,17.59 C6.2 | v71.28,22.38 71.28,21.46 C5.2 | C28.1 v69.06,9.21 C29.1 | U5.7 v45.39,22.23 v45.4,22.23 | U5.5 46.69,22.23 v46.67,22.23 | R9.2 v48.9,24.13 | C7.2 v53.34,24.13 | R10.2 v48.9,12.06 | C10.2 v53.34,12.06 | U5.3 v46.05,13.97 v46.04,13.97 | U5.1 44.76,13.97 v44.77,13.97 | C30.2 54.1,27.3 v53.18,27.3 | U8.2 v57.31,26.51 | U$29.20 v39.85,4.45 | U$24.20 v39.85,22.23 | U3.15 24.92,1.24 C16.1 v23.81,1.11 | R15.1 v15.56,9.05 | C15.1 21.75,16.19 v22.54,16.99 23.34,16.19 C14.2 | C23.2 v28.73,17.3 | LED7.C v20.32,18.41 | LED6.C v20.32,19.84 19.21,20.95 C4.2 | C24.2 v43.97,30.64 | C20.2 v43.97,12.86 | C19.2 v28.57,35.08 | LED3.C v24.77,33.97 | LED5.C v24.77,32.54 | U2.1 15.52,28.93 | 16.73,24.77 v15.72,24.77 | v17.94,24.77 16.92,24.77 | v16.83,23.65 16.83,24.67 | 7.21,24.77 v6.19,24.77 | 7.46,24.77 v8.41,24.77 | v7.3,23.65 7.3,24.61 | v14.29,30.16 14.29,29 | v15.56,16.99 16.73,16.99 C27.2 | v18.1,16.99 16.92,16.99 C27.2 | v16.83,15.88 C27.2 | 14.45,21.23 v14.45,22.38 | 14.45,21.23 U7.1 | v15.56,21.11 14.56,21.11 14.45,21.23 | 7.21,16.99 v6.03,16.99 | 7.21,16.99 C26.2 7.4,16.99 v8.57,16.99 | v7.3,15.88 7.3,16.89 7.21,16.99 | U1.23 62.17,15.62 61.91,15.88 v60.96,15.88
  Top 0.406: C9.2 54.29,17.43 v54.29,17.46 | C8.2 54.29,18.76 v54.29,18.73 | 15.52,28.93 v15.56,28.89 | 16.92,24.77 C2.2 16.73,24.77 16.83,24.67 | C1.2 7.21,24.77 7.46,24.77 7.3,24.61 | 14.29,29 U2.1
  pour Bottom: 0,0 78.9,0 78.9,37.94 0,37.94
N$1
  Top 0.305: R14.1 17.18,3.37 U3.9
N$5
  Top 0.305: U1.27 62.79,17.7 62.07,18.41 62.07,21.59 62.39,21.91 63.18,21.91 64.93,23.65 R7.1
N$8
  Top 0.305: U3.4 22.38,14.48 C13.1
N$9
  Top 0.305: U3.3 23.65,14.1 C12.2
N$10
  Top 0.305: U3.1 26.19,14.1 C12.1
N$12
  Top 0.305: C28.2 66.64,9.3 Q1.1 66.64,16.13 R12.2
N$13
  Top 0.305: U3.6 19.84,15.84 C15.2
N$15
  Top 0.305: U3.2 24.92,16.16 C14.1
N$20
  Top 0.305: U3.5 21.11,14.48 C13.2
N$25
  Top 0.305: U$29.2 38.58,15.05 Q3.2
  Bottom 0.305: C22.2 40.35,18.32 Q3.2
N$26
  Top 0.305: U$24.2 38.58,32.83 Q2.2
  Bottom 0.305: Q2.2 40.35,36.1 C18.2
N$27
  Top 0.305: U$24.3 37.31,32.83 Q2.1
  Bottom 0.305: Q2.1 35.53,36.1 C17.1
N$28
  Top 0.305: U$29.3 37.31,15.05 Q3.1
  Bottom 0.305: C21.1 35.53,18.32 Q3.1
N$29
  Top 0.305: U$24.6 33.5,32.07 33.02,32.54 R21.1
N$36
  Top 0.305: U$24.5 34.77,32.07 33.02,33.81 R20.1
N$43
  Top 0.305: U$24.4 36.04,32.07 33.02,35.08 C19.1 30.96,35.08 29.69,36.35 R19.1
N$44
  Top 0.305: U$29.6 33.5,14.29 33.02,14.76 R24.1
N$45
  Top 0.305: U$29.5 34.77,14.45 33.18,16.03 R23.1
N$46
  Top 0.305: R20.2 28.2,33.81 LED3.A
N$47
  Top 0.305: R21.2 LED5.A
N$48
  Top 0.305: U$29.4 36.04,14.45 33.18,17.3 C23.1 31.11,17.3 29.84,18.57 R22.1
N$55
  Top 0.305: R23.2 28.42,16.03 24.61,19.84 LED6.A
N$56
  Top 0.305: R24.2 28.26,14.76 24.61,18.41 LED7.A
RESET
  Top 0.305: U1.4 60.57,23.88 59.05,25.4 U8.1 59.07,25.57 59.69,26.19 59.69,26.99 59.98,27.27 R13.2
RS232RX
  Top 0.305: J3.3 J4.2 13.02,7.94 14.92,9.84 16.19,9.84 17.3,10.95 U3.8
RS232TX
  Top 0.305: J3.2 J4.1 15.72,10.48 16.35,11.11 16.35,13.49 16.83,13.97 17.94,13.97 18.57,13.34 U3.7
XTAL1
  Top 0.305: C29.2 71.47,9.3 Q1.2 69.06,15.11 69.06,16.83 65.8,20.09 U1.30
XTAL2
  Top 0.305: R12.1 68.23,16.86 65.79,19.3 U1.29

### Text on the board
tPlace: USB to UART / Bridge V1